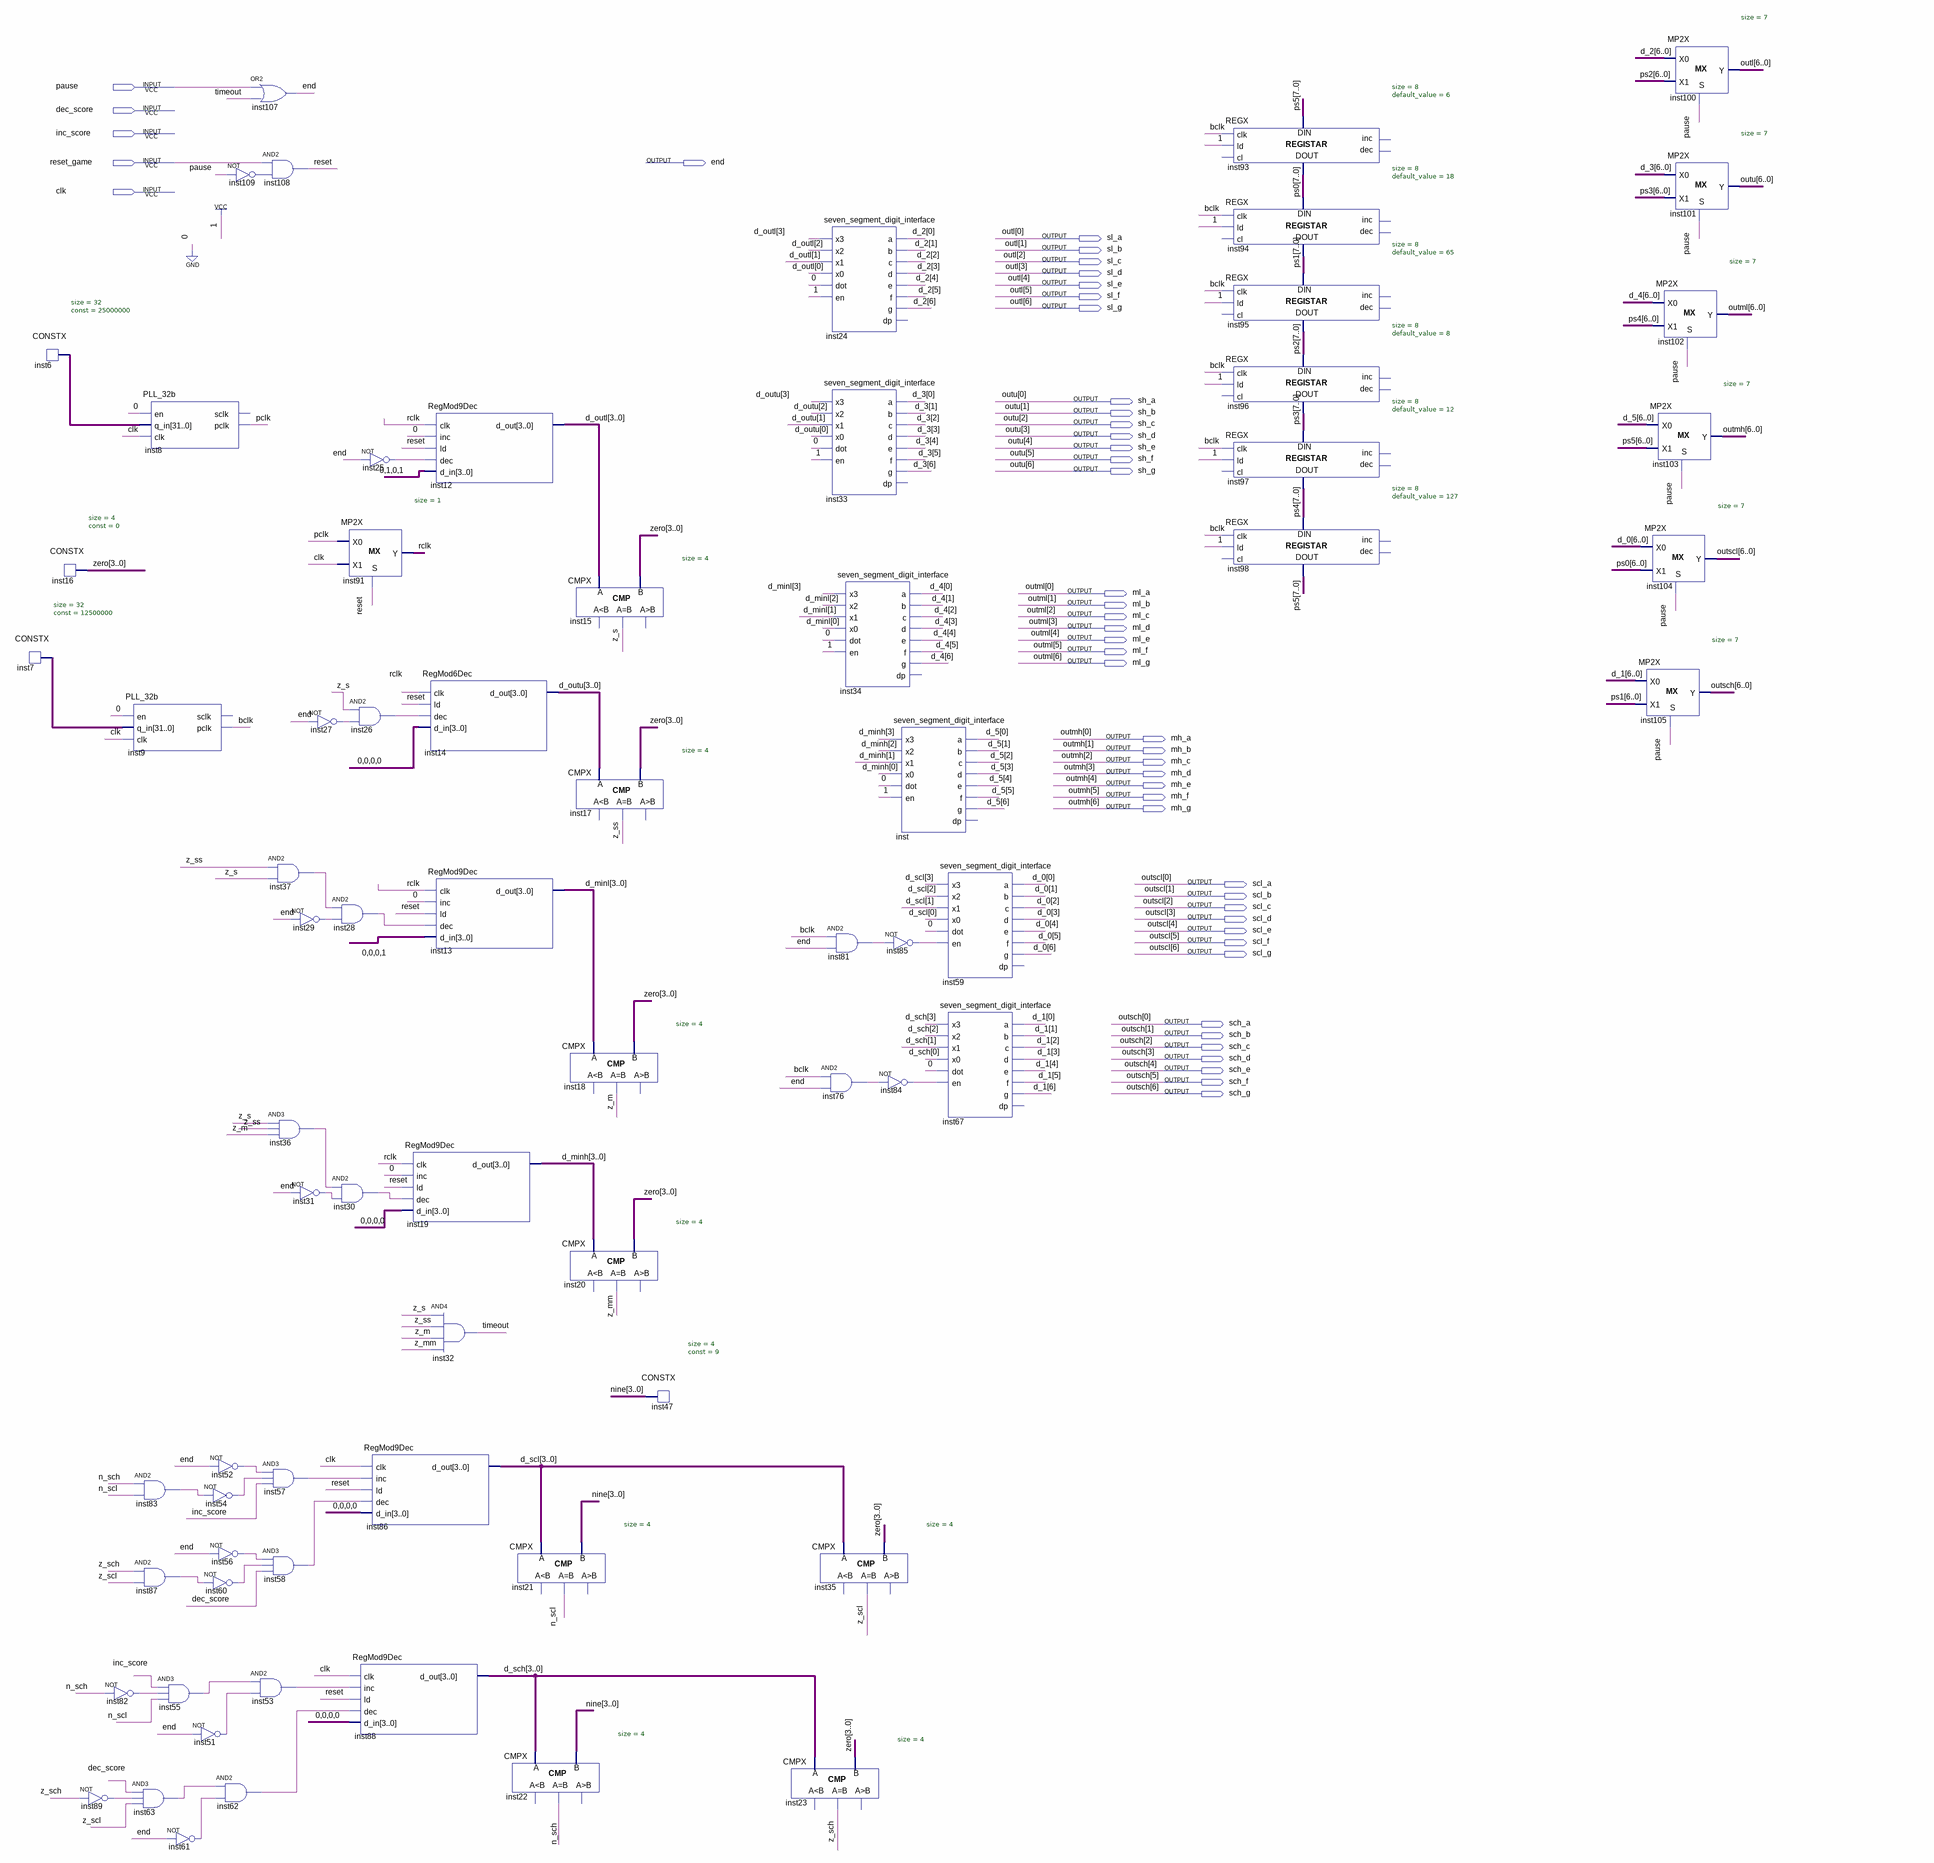
[diagram p0: schematic sheet]
// Quartus schematic SSController.bdf as structural Verilog: 72 symbols, 48 pins
module SSController (
  input  pause,
  input  dec_score,
  input  inc_score,
  input  reset_game,
  input  clk,
  output \end ,
  output sl_a,
  output sl_b,
  output sl_c,
  output sl_d,
  output sl_e,
  output sl_f,
  output sl_g,
  output sh_a,
  output sh_b,
  output sh_c,
  output sh_d,
  output sh_e,
  output sh_f,
  output sh_g,
  output ml_a,
  output ml_b,
  output ml_c,
  output ml_d,
  output ml_e,
  output ml_f,
  output ml_g,
  output mh_a,
  output mh_b,
  output mh_c,
  output mh_d,
  output mh_e,
  output mh_f,
  output mh_g,
  output scl_a,
  output scl_b,
  output scl_c,
  output scl_d,
  output scl_e,
  output scl_f,
  output scl_g,
  output sch_a,
  output sch_b,
  output sch_c,
  output sch_d,
  output sch_e,
  output sch_f,
  output sch_g
);

  wire bclk, inst25_out, inst26_out, inst27_out, inst28_out, inst29_out, inst30_out, inst31_out, inst36_out,
       inst37_out, inst51_out, inst52_out, inst53_out, inst54_out, inst55_out, inst56_out, inst57_out,
       inst58_out, inst60_out, inst61_out, inst62_out, inst63_out, inst76_out, inst81_out, inst82_out,
       inst83_out, inst84_out, inst85_out, inst87_out, inst89_out, inst109_out, n_sch, n_scl, pclk, rclk,
       reset, timeout, z_m, z_mm, z_s, z_sch, z_scl, z_ss;
  wire [3:0] d_minh, d_minl, d_outl, d_outu, d_sch, d_scl, nine, zero;
  wire [6:0] d_0, d_1, d_2, d_3, d_4, d_5;
  wire [7:0] ps0, ps1, ps2, ps3, ps4, ps5;
  wire [31:0] inst6_data, inst7_data;

  CONSTX #(.size(32), .\const (25000000)) inst6 (.data(inst6_data));
  CONSTX #(.size(32), .\const (12500000)) inst7 (.data(inst7_data));
  CONSTX #(.size(4), .\const (0)) inst16 (.data(zero));
  not inst89 (inst89_out, z_sch);
  PLL_32b inst9 (.en(1'b0), .q_in(inst7_data), .clk(clk), .pclk(bclk));  // open: sclk
  and inst83 (inst83_out, n_sch, n_scl);
  and inst87 (inst87_out, z_sch, z_scl);
  not inst82 (inst82_out, n_sch);
  and inst63 (inst63_out, dec_score, inst89_out, z_scl);
  PLL_32b inst8 (.en(1'b0), .q_in(inst6_data), .clk(clk), .pclk(pclk));  // open: sclk
  and inst55 (inst55_out, inc_score, inst82_out, n_scl);
  not inst61 (inst61_out, \end );
  not inst109 (inst109_out, pause);
  not inst52 (inst52_out, \end );
  not inst54 (inst54_out, inst83_out);
  not inst56 (inst56_out, \end );
  not inst60 (inst60_out, inst87_out);
  not inst51 (inst51_out, \end );
  and inst62 (inst62_out, inst63_out, inst61_out);
  or inst107 (\end , pause, timeout);
  and inst108 (reset, reset_game, inst109_out);
  and inst37 (inst37_out, z_ss, z_s);
  and inst36 (inst36_out, z_s, z_ss, z_m);
  and inst57 (inst57_out, inst52_out, inst54_out, inc_score);
  and inst58 (inst58_out, inst56_out, inst60_out, dec_score);
  and inst53 (inst53_out, inst55_out, inst51_out);
  not inst27 (inst27_out, \end );
  not inst29 (inst29_out, \end );
  not inst31 (inst31_out, \end );
  not inst25 (inst25_out, \end );
  MP2X #(.size(1)) inst91 (.S(reset), .X0(pclk), .X1(clk), .Y(rclk));
  and inst26 (inst26_out, z_s, inst27_out);
  and inst28 (inst28_out, inst37_out, inst29_out);
  and inst30 (inst30_out, inst36_out, inst31_out);
  RegMod9Dec inst86 (.clk(clk), .inc(inst57_out), .ld(reset), .dec(inst58_out), .d_in(4'b0000), .d_out(d_scl));
  RegMod9Dec inst88 (.clk(clk), .inc(inst53_out), .ld(reset), .dec(inst62_out), .d_in(4'b0000), .d_out(d_sch));
  RegMod9Dec inst19 (.clk(rclk), .inc(1'b0), .ld(reset), .dec(inst30_out), .d_in(4'b0000), .d_out(d_minh));
  RegMod9Dec inst12 (.clk(rclk), .inc(1'b0), .ld(reset), .dec(inst25_out), .d_in(4'b0101), .d_out(d_outl));
  RegMod6Dec inst14 (.clk(rclk), .ld(reset), .dec(inst26_out), .d_in(4'b0000), .d_out(d_outu));
  RegMod9Dec inst13 (.clk(rclk), .inc(1'b0), .ld(reset), .dec(inst28_out), .d_in(4'b0001), .d_out(d_minl));
  and inst32 (timeout, z_s, z_ss, z_m, z_mm);
  CMPX #(.size(4)) inst21 (.A(d_scl), .B(nine), .eq(n_scl));  // open: ls, gr
  CMPX #(.size(4)) inst22 (.A(d_sch), .B(nine), .eq(n_sch));  // open: ls, gr
  CMPX #(.size(4)) inst15 (.A(d_outl), .B(zero), .eq(z_s));  // open: ls, gr
  CMPX #(.size(4)) inst17 (.A(d_outu), .B(zero), .eq(z_ss));  // open: ls, gr
  CMPX #(.size(4)) inst18 (.A(d_minl), .B(zero), .eq(z_m));  // open: ls, gr
  CMPX #(.size(4)) inst20 (.A(d_minh), .B(zero), .eq(z_mm));  // open: ls, gr
  CONSTX #(.size(4), .\const (9)) inst47 (.data(nine));
  CMPX #(.size(4)) inst23 (.A(d_sch), .B(zero), .eq(z_sch));  // open: ls, gr
  seven_segment_digit_interface inst24 (
    .x3(d_outl[3]), .x2(d_outl[2]), .x1(d_outl[1]), .x0(d_outl[0]), .dot(1'b0), .en(1'b1), .a(d_2[0]),
    .b(d_2[1]), .c(d_2[2]), .d(d_2[3]), .e(d_2[4]), .f(d_2[5]), .g(d_2[6]));  // open: dp
  seven_segment_digit_interface inst33 (
    .x3(d_outu[3]), .x2(d_outu[2]), .x1(d_outu[1]), .x0(d_outu[0]), .dot(1'b0), .en(1'b1), .a(d_3[0]),
    .b(d_3[1]), .c(d_3[2]), .d(d_3[3]), .e(d_3[4]), .f(d_3[5]), .g(d_3[6]));  // open: dp
  seven_segment_digit_interface inst34 (
    .x3(d_minl[3]), .x2(d_minl[2]), .x1(d_minl[1]), .x0(d_minl[0]), .dot(1'b0), .en(1'b1), .a(d_4[0]),
    .b(d_4[1]), .c(d_4[2]), .d(d_4[3]), .e(d_4[4]), .f(d_4[5]), .g(d_4[6]));  // open: dp
  and inst81 (inst81_out, bclk, \end );
  and inst76 (inst76_out, bclk, \end );
  CMPX #(.size(4)) inst35 (.A(d_scl), .B(zero), .eq(z_scl));  // open: ls, gr
  not inst84 (inst84_out, inst76_out);
  seven_segment_digit_interface inst (
    .x3(d_minh[3]), .x2(d_minh[2]), .x1(d_minh[1]), .x0(d_minh[0]), .dot(1'b0), .en(1'b1), .a(d_5[0]),
    .b(d_5[1]), .c(d_5[2]), .d(d_5[3]), .e(d_5[4]), .f(d_5[5]), .g(d_5[6]));  // open: dp
  not inst85 (inst85_out, inst81_out);
  seven_segment_digit_interface inst59 (
    .x3(d_scl[3]), .x2(d_scl[2]), .x1(d_scl[1]), .x0(d_scl[0]), .dot(1'b0), .en(inst85_out), .a(d_0[0]),
    .b(d_0[1]), .c(d_0[2]), .d(d_0[3]), .e(d_0[4]), .f(d_0[5]), .g(d_0[6]));  // open: dp
  seven_segment_digit_interface inst67 (
    .x3(d_sch[3]), .x2(d_sch[2]), .x1(d_sch[1]), .x0(d_sch[0]), .dot(1'b0), .en(inst84_out), .a(d_1[0]),
    .b(d_1[1]), .c(d_1[2]), .d(d_1[3]), .e(d_1[4]), .f(d_1[5]), .g(d_1[6]));  // open: dp
  REGX #(.size(8), .default_value(6)) inst93 (
    .clk(bclk), .ld(1'b1), .data_in(ps5), .data_out(ps0));  // open: cl, inc, dec
  REGX #(.size(8), .default_value(18)) inst94 (
    .clk(bclk), .ld(1'b1), .data_in(ps0), .data_out(ps1));  // open: cl, inc, dec
  REGX #(.size(8), .default_value(65)) inst95 (
    .clk(bclk), .ld(1'b1), .data_in(ps1), .data_out(ps2));  // open: cl, inc, dec
  REGX #(.size(8), .default_value(8)) inst96 (
    .clk(bclk), .ld(1'b1), .data_in(ps2), .data_out(ps3));  // open: cl, inc, dec
  REGX #(.size(8), .default_value(12)) inst97 (
    .clk(bclk), .ld(1'b1), .data_in(ps3), .data_out(ps4));  // open: cl, inc, dec
  REGX #(.size(8), .default_value(127)) inst98 (
    .clk(bclk), .ld(1'b1), .data_in(ps4), .data_out(ps5));  // open: cl, inc, dec
  MP2X #(.size(7)) inst100 (.S(pause), .X0(d_2), .X1(ps2[6:0]), .Y({sl_g, sl_f, sl_e, sl_d, sl_c, sl_b, sl_a}));
  MP2X #(.size(7)) inst101 (.S(pause), .X0(d_3), .X1(ps3[6:0]), .Y({sh_g, sh_f, sh_e, sh_d, sh_c, sh_b, sh_a}));
  MP2X #(.size(7)) inst102 (.S(pause), .X0(d_4), .X1(ps4[6:0]), .Y({ml_g, ml_f, ml_e, ml_d, ml_c, ml_b, ml_a}));
  MP2X #(.size(7)) inst103 (.S(pause), .X0(d_5), .X1(ps5[6:0]), .Y({mh_g, mh_f, mh_e, mh_d, mh_c, mh_b, mh_a}));
  MP2X #(.size(7)) inst104 (.S(pause), .X0(d_0), .X1(ps0[6:0]), .Y({scl_g, scl_f, scl_e, scl_d, scl_c, scl_b, scl_a}));
  MP2X #(.size(7)) inst105 (.S(pause), .X0(d_1), .X1(ps1[6:0]), .Y({sch_g, sch_f, sch_e, sch_d, sch_c, sch_b, sch_a}));

  // Other names for the same wires on the sheet: outl[6:0] = {sl_g, sl_f, sl_e, sl_d, sl_c, sl_b, sl_a};
  //   outmh[6:0] = {mh_g, mh_f, mh_e, mh_d, mh_c, mh_b, mh_a};
  //   outml[6:0] = {ml_g, ml_f, ml_e, ml_d, ml_c, ml_b, ml_a};
  //   outsch[6:0] = {sch_g, sch_f, sch_e, sch_d, sch_c, sch_b, sch_a};
  //   outscl[6:0] = {scl_g, scl_f, scl_e, scl_d, scl_c, scl_b, scl_a};
  //   outu[6:0] = {sh_g, sh_f, sh_e, sh_d, sh_c, sh_b, sh_a}
endmodule
